# EAGLE design WSTL18P2 (EAGLE 7.7.0)
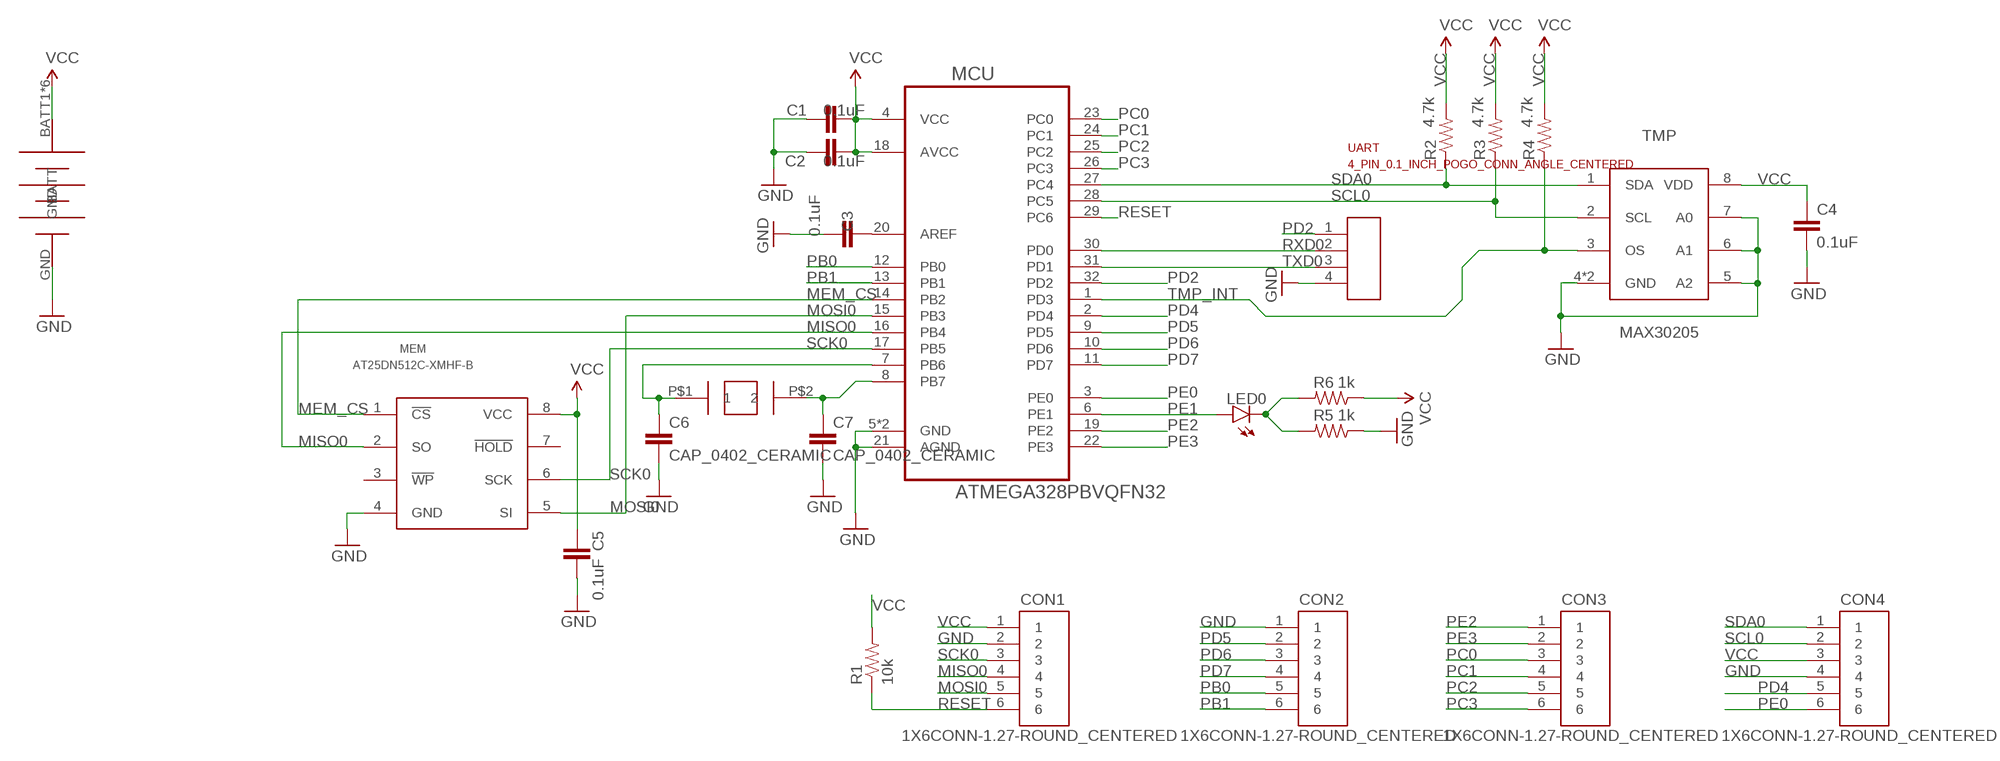
[diagram p0: schematic, sheet 1]

## Parts
C1  0.1uF  CAP_0402  [SMD_0402]
C2  0.1uF  CAP_0402  [SMD_0402]
C3  0.1uF  CAP_0402  [SMD_0402]
C4  0.1uF  CAP_0402_CERAMIC  [CAP_0402]
C5  0.1uF  CAP_0402_CERAMIC  [CAP_0402]
C6  CAP_0402_CERAMIC  [CAP_0402]
C7  CAP_0402_CERAMIC  [CAP_0402]
CON1  1X6CONN-1.27-ROUND_CENTERED  [1X6_1.27_ROUND_CENTERED]
CON2  1X6CONN-1.27-ROUND_CENTERED  [1X6_1.27_ROUND_CENTERED]
CON3  1X6CONN-1.27-ROUND_CENTERED  [1X6_1.27_ROUND_CENTERED]
CON4  1X6CONN-1.27-ROUND_CENTERED  [1X6_1.27_ROUND_CENTERED]
LED0  LED_0402  [LED_0402]
MCU  ATMEGA328PBVQFN32  [ATMEGA328PB_VFQFN32]
MEM  AT25DN512C-XMHF-B  [TSSSOP-8]
R1  10k  RES_0402_CERAMIC  [RES_0402]
R2  4.7k  RES_0402_CERAMIC  [RES_0402]
R3  4.7k  RES_0402_CERAMIC  [RES_0402]
R4  4.7k  RES_0402_CERAMIC  [RES_0402]
R5  1k  RES_0402_CERAMIC  [RES_0402]
R6  1k  RES_0402_CERAMIC  [RES_0402]
T1  ABS07AIG  [ABS07AIG]
TMP  MAX30205  [MAX30205_TDFN8]
U$1  LINX-CR2032-BAT-HLD-M-THM  [CR2032-LINX-M-THM]
UART  4_PIN_0.1_INCH_POGO_CONN_ANGLE_CENTERED  [4_PIN_0.1"_POGO_ANGLE_CENTERED]

## Nets
AREF: C3.1 MCU.20(AREF)
GND [GND]: C1.2 C2.2 C3.2 C4.2 C5.2 C6.2 C7.2 CON1.2 CON2.1 CON4.4 MCU.5(GND) MCU.21(AGND) MCU.PAD(GND) MEM.4(GND) R5.2 TMP.4(GND) TMP.5(A2) TMP.6(A1) TMP.7(A0) TMP.PAD(GND) U$1.GND UART.4
MEM_CS [Signal]: MCU.14(PB2) MEM.1(!CS!)
MISO0 [Signal]: CON1.4 MCU.16(PB4) MEM.2(SO)
MOSI0 [Signal]: CON1.5 MCU.15(PB3) MEM.5(SI)
N$1 [Signal]: C7.1 MCU.8(PB7) T1.P$2
N$2 [Signal]: C6.1 MCU.7(PB6) T1.P$1
N$4: LED0.CATHODE(C) R5.1 R6.1
PB0: CON2.5 MCU.12(PB0)
PB1: CON2.6 MCU.13(PB1)
PC0: CON3.3 MCU.23(PC0)
PC1: CON3.4 MCU.24(PC1)
PC2: CON3.5 MCU.25(PC2)
PC3: CON3.6 MCU.26(PC3)
PD2: MCU.32(PD2) UART.1
PD4: CON4.5 MCU.2(PD4)
PD5: CON2.2 MCU.9(PD5)
PD6: CON2.3 MCU.10(PD6)
PD7: CON2.4 MCU.11(PD7)
PE0: CON4.6 MCU.3(PE0)
PE1: LED0.ANODE(A) MCU.6(PE1)
PE2: CON3.1 MCU.19(PE2)
PE3: CON3.2 MCU.22(PE3)
RESET [Signal]: CON1.6 MCU.29(PC6) R1.2
RXD0 [Signal]: MCU.30(PD0) UART.2
SCK0 [Signal]: CON1.3 MCU.17(PB5) MEM.6(SCK)
SCL0 [Signal]: CON4.2 MCU.28(PC5) R3.2 TMP.2(SCL)
SDA0 [Signal]: CON4.1 MCU.27(PC4) R2.2 TMP.1(SDA)
TMP_INT: MCU.1(PD3) R4.2 TMP.3(OS)
TXD0 [Signal]: MCU.31(PD1) UART.3
VCC: C1.1 C2.1 C4.1 C5.1 CON1.1 CON4.3 MCU.4(VCC) MCU.18(AVCC) MEM.8(VCC) R1.1 R2.1 R3.1 R4.1 R6.2 TMP.8(VDD) U$1.BATT1(BATT) U$1.BATT2(BATT) U$1.BATT3(BATT) U$1.BATT4(BATT) U$1.BATT5(BATT) U$1.BATT6(BATT)
Unconnected: MEM.3(!WP!) MEM.7(!HOLD!)

## Library data of the parts
C1-C3 = Passives:CAP_0402: 0402 capacitor
C4-C7 = Passives:CAP_0402_CERAMIC
CON1-CON4 = AVR_ISP_127:1X6CONN-1.27-ROUND_CENTERED
LED0 = Passives:LED_0402
MCU = ATMEGA328PB:ATMEGA328PB: Atmel's new 8-bit Microcontroller with In-System Programmable Flash and other goodies to replace venerable 328P
MEM = Memory:AT25DN512C-XMHF-B
R1-R6 = Passives:RES_0402_CERAMIC
T1 = ABS07AIG:ABS07AIG: Abracon ABS07AIG crystal
TMP = MAX30205:MAX30205: MAX30205 Temperature sensor by Maxim
U$1 = Battery_holders:LINX-CR2032-BAT-HLD-M-THM
UART = Connectors:4_PIN_0.1_INCH_POGO_CONN_ANGLE_CENTERED

## Net classes
1 GND: width 0.254 mm, drill 0.305 mm, clearance 0.356 mm
2 Signal: width 0.203 mm, drill 0.305 mm, clearance 0.203 mm

## Board
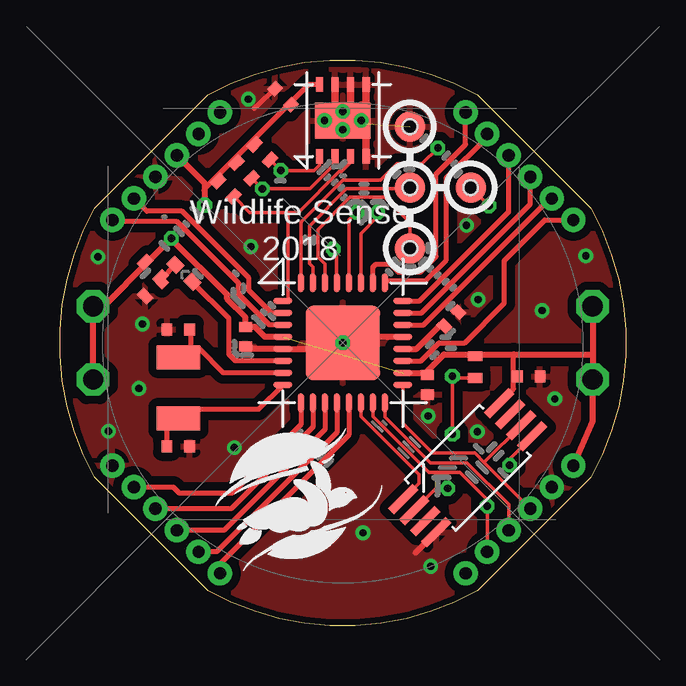
[diagram p1: board, top side]
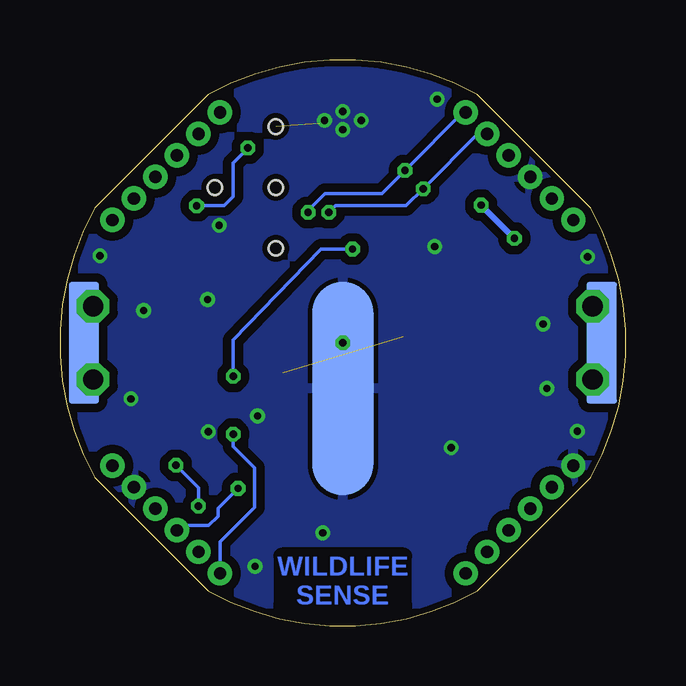
[diagram p2: board, bottom side, seen from below]

Size 23.59 x 23.59 mm. Coordinates in mm from the lower left corner, seen from the top.
Outline: 6.18,1.46 1.46,6.18 arc-59 1.46,17.41 6.18,22.13 arc-59 17.41,22.13 22.13,17.41 arc-59 22.13,6.18 17.41,1.46 arc-59 6.18,1.46
Copper layers (1*16): Top 0.035mm / dielectric 1.5mm / Bottom 0.035mm
Design rules "Nikos-SeeedStudio_2layer_DRU_no_angle_20140221": minimum track width 6mil, minimum drill 12mil, track to track 6mil, track to pad 10mil, pad to pad 10mil, via to via 10mil, smd to smd 6mil, copper to edge 10mil, drill to drill 10mil, minimum pad ring 10mil, minimum via ring 6mil, stop-mask expansion 0mil, vias tented up to drill 100mil, thermal gap 8mil
Holes 0.6 mm at 14.59,20.81 14.59,18.27 17.13,18.27 14.59,15.73

### Footprints (pad centres in the part's own frame; a part is rotated, then mirrored left to right if it is on the bottom)
SMD_0402 = smd 0.54 x 0.42: 1 0,0.41; 2 0,-0.41
CAP_0402 = smd 0.45 x 0.5: 1 -0.475,0; 2 0.475,0
1X6_1.27_ROUND_CENTERED = drill 0.508 pad 0.813: 1 -3.175,0; 2 -1.905,0; 3 -0.635,0; 4 0.635,0; 5 1.905,0; 6 3.175,0
LED_0402 = smd 0.6 x 0.5: ANODE -0.5,0; CATHODE 0.5,0
ATMEGA328PB_VFQFN32 = smd 0.8 x 0.25: 1 -2.5,1.75; 2 -2.5,1.25; 3 -2.5,0.75; 4 -2.5,0.25; 5 -2.5,-0.25; 6 -2.5,-0.75; 7 -2.5,-1.25; 8 -2.5,-1.75; 17 2.5,-1.75; 18 2.5,-1.25; 19 2.5,-0.75; 20 2.5,-0.25; 21 2.5,0.25; 22 2.5,0.75; 23 2.5,1.25; 24 2.5,1.75 | smd 0.25 x 0.8: 9 -1.75,-2.5; 10 -1.25,-2.5; 11 -0.75,-2.5; 12 -0.25,-2.5; 13 0.25,-2.5; 14 0.75,-2.5; 15 1.25,-2.5; 16 1.75,-2.5; 25 1.75,2.5; 26 1.25,2.5; 27 0.75,2.5; 28 0.25,2.5; 29 -0.25,2.5; 30 -0.75,2.5; 31 -1.25,2.5; 32 -1.75,2.5 | smd 3.1 x 3.1: PAD 0,0
TSSSOP-8 = smd 1.45 x 0.35: 1 -2.825,0.975; 2 -2.825,0.325; 3 -2.825,-0.325; 4 -2.825,-0.975; 5 2.825,-0.975; 6 2.825,-0.325; 7 2.825,0.325; 8 2.825,0.975
RES_0402 = smd 0.4 x 0.6: 1 -0.45,0; 2 0.45,0
ABS07AIG = smd 1.8 x 1: P$1 0,1.275; P$2 0,-1.275
MAX30205_TDFN8 = smd 0.6 x 0.3: 1 -1.5,0.975; 2 -1.5,0.325; 3 -1.5,-0.325; 4 -1.5,-0.975; 5 1.5,-0.975; 6 1.5,-0.325; 7 1.5,0.325; 8 1.5,0.975 | smd 1.5 x 2.3: PAD 0,0
CR2032-LINX-M-THM = drill 0.838 octagon: BATT1 -10.414,1.524; BATT2 -10.414,-1.524; BATT3 10.414,-1.524; BATT4 10.414,1.524 | smd 1.27 x 5.08: BATT5 -10.795,0; BATT6 10.795,0 | smd 2.54 x 8.89: GND 0,-1.905
4_PIN_0.1"_POGO_ANGLE_CENTERED = smd 1.27 x 1.27: 1 0,2.54; 2 2.54,0; 3 0,0; 4 -2.54,0

### Placement (x,y rotation side)
C1  7.73,12.05 0 top
C2  15.33,10.04 0 top
C3  16.32,12.79 135 top
C4  9.31,22.06 135 top
C5  19.54,10.4 0 top
C6  4.94,12.35 180 top
C7  4.94,7.48 0 top
CON1  19.16,4.43 225 top
CON2  4.43,4.43 315 top
CON3  19.16,19.16 135 top
CON4  4.43,19.16 225 top
LED0  5.17,14.69 135 top
MCU  11.8,11.8 0 top
MEM  17,6.59 45 top
R1  17.31,10.78 270 top
R2  8.44,19.75 315 top
R3  7.68,18.98 315 top
R4  6.92,18.22 315 top
R5  3.87,14.06 225 top
R6  3.87,14.84 135 top
T1  4.94,9.92 0 top
TMP  11.8,21.07 90 top
U$1  11.8,11.8 0 bottom
UART  14.59,18.27 270 top

### Tracks (layer width: path | path; a pad name or v marks a point on that pad's centre or on a via)
AREF
  Top 0.249: MCU.20 14.87,11.55 15.82,12.5 C3.1
GND  (via drill 0.3)  (1 unrouted)
  Top 0.203: C4.2 8.24,21.68 8.11,21.57
  Top 0.249: 11.03,11.55 MCU.5 8.05,11.55
  Top 0.254: 11.03,11.55 11.28,11.8 MCU.PAD 12.05,12.05 MCU.21 | 14.84,3.06 15.61,3.82 | 8.05,11.55 C1.2
  Top 0.305: TMP.4 12.77,20.94 v12.56,21.07 | TMP.5 12.77,21.7 12.56,21.7 | TMP.6 12.12,21.45 v11.8,21.45 | TMP.7 11.47,21.7 v11.03,21.07
  other vias: 2.02,8.11 11.8,20.69 3.29,9.89 15.35,8.75 21.93,15.43 1.58,15.38 7.27,7.43 7.96,15.81 20.63,9.46 20.1,13.14 16.95,16.7 15.45,2.47 12.63,3.87 3.44,12.58 7.86,21.96 11.8,11.8 17.43,13.6 17.41,8.09
  pour Bottom: -1.41,-1.41 25.77,-1.41 25.77,26.4 -1.41,26.4
  pour Top: -1.41,-1.41 25.13,-1.41 25.13,26.02 -1.41,26.02
MEM_CS
  Top 0.152: MCU.14 12.55,8.73 14.97,6.31 14.97,5.94 MEM.1
MISO0  (via drill 0.3)
  Top 0.152: MCU.16 13.55,8.7 15.45,6.79 16.98,6.79 18.71,5.06 CON1.4 | MEM.2 15.68,5.72 v16.16,5.72
  Bottom 0.152: v16.16,5.72 17,4.89 17,4.56 17.38,4.18 18.52,4.18 CON1.4
MOSI0  (via drill 0.3)
  Top 0.152: MCU.15 13.05,8.72 15.38,6.39 16.67,6.39 17.81,5.24 v17.81,4.99 CON1.5 | MEM.5 18.76,6.96 v18.76,6.69
  Bottom 0.152: v18.76,6.69 17.81,5.75 v17.81,4.99
N$1
  Top 0.203: MCU.8 8.27,9.02 4.94,9.02 T1.P$2 4.46,8.64 C7.1
N$2
  Top 0.203: MCU.7 6.82,10.55 5.8,11.57 5.45,11.57 | 4.91,11.16 T1.P$1 4.94,11.57 5.45,11.57 | C6.1 5.45,12.35 5.45,11.57
N$4
  Top 0.203: R5.1 R6.1 4.29,14.53 LED0.CATHODE
PB0
  Top 0.203: MCU.12 11.55,8.07 6.63,3.17 6.54,3.08 CON2.5
PB1
  Top 0.203: MCU.13 12.05,7.96 6.67,2.59 CON2.6
PC0
  Top 0.203: MCU.23 15.08,13.05 19.61,17.58 CON3.3
PC1
  Top 0.203: MCU.24 14.99,13.55 18.71,17.26 CON3.4
PC2
  Top 0.203: MCU.25 13.64,14.39 15.25,14.39 16.11,15.25 16.11,18.68 17.81,20.38 CON3.5
PC3
  Top 0.203: MCU.26 13.05,14.95 13.17,15.07 13.78,15.07 14.11,14.74 15.02,14.74 15.68,15.4 15.68,18.83 16.92,20.07 CON3.6
PD2  (via drill 0.3)
  Top 0.152: MCU.32 10.05,16.83 11.8,18.58 13.37,18.58 14.06,19.26 15.1,19.26 v15.76,19.92 | v17.89,17.51 UART.1
  Bottom 0.152: v15.76,19.92 15.76,19.9 16.37,19.29 16.37,17.89 16.75,17.51 v17.89,17.51
PD4
  Top 0.203: MCU.2 8.82,13.05 7.88,13.98 7.88,14.49 5.09,17.28 3.62,17.28 CON4.5
PD5
  Top 0.203: MCU.9 10.05,8.39 7.17,5.52 4.99,5.52 4.73,5.78 CON2.2
PD6
  Top 0.203: MCU.10 10.55,8.28 7.14,4.88 CON2.3
PD7
  Top 0.203: MCU.11 11.05,8.18 6.85,3.98 CON2.4
PE0
  Top 0.203: MCU.3 8.73,12.55 7.45,13.83 7.45,14.28 4.89,16.85 2.26,16.85 CON4.6
PE1
  Top 0.203: MCU.6 7.31,11.05 7.05,11.31 7.05,12.81 LED0.ANODE
PE2
  Top 0.203: MCU.19 15.06,11.05 15.81,11.8 16.88,11.8 18.53,13.45 18.53,15.22 20.22,16.92 CON3.1
PE3
  Top 0.203: MCU.22 15.16,12.55 20.43,17.81 CON3.2
RESET  (via drill 0.3)
  Top 0.152: MCU.29 11.54,15.55 v11.39,15.71 | R1.2 16.44,10.33 v16.37,10.4 v16.37,7.99
  Top 0.254: MCU.29
  Bottom 0.152: v11.39,15.71 12.71,15.71 16.37,11.92 v16.37,10.4 | v16.37,7.99 16.37,7.48 15.48,6.59 15.48,4.94 16.92,3.5 CON1.6
RXD0
  Top 0.152: MCU.30 11.05,15.09 10.75,15.38 10.75,16.52 12.1,17.87 13.52,17.87 14.59,16.8 UART.2
SCK0
  Top 0.152: MCU.17 14.3,8.43 15.53,7.2 17.3,7.2 17.71,6.79 | CON1.3 17.71,6.79 | MEM.6 17.71,6.83 17.71,6.79
SCL0  (via drill 0.3)
  Top 0.152: MCU.28 12.05,16.93 v12.38,17.23 | R3.2 v8.44,18.22 | v8.44,18.22 | v8.44,18.22 10.42,18.22 11.47,19.27 TMP.2
  Bottom 0.152: v12.38,17.23 12.1,17.51 9.15,17.51 v8.44,18.22 6.16,20.51 CON4.2
SDA0  (via drill 0.3)
  Top 0.152: R2.2 v9.2,18.98 | v9.2,18.98 | MCU.27 12.55,16.36 13.24,17.05 v13.24,17.23 | v9.2,18.98 10.6,18.98 10.82,19.2 TMP.1
  Bottom 0.152: v13.24,17.23 13.24,17.31 12.53,18.02 10.17,18.02 v9.2,18.98 6.78,21.41 CON4.1
TMP_INT
  Top 0.152: TMP.3 12.12,19.3 11.75,18.93 11.64,18.93 9.94,17.23 9.51,17.23 | MCU.1 9.51,13.55 9.51,17.23 | 9.51,17.23 7.91,17.23 R4.2
TXD0
  Top 0.152: MCU.31 10.55,14.95 10.4,15.1 10.4,16.67 11.95,18.22 14.54,18.22 UART.3
VCC  (via drill 0.3)  (1 unrouted)
  Top 0.203: C2.1 15.48,10.55 | 6.06,17.54 v6.03,17.54 | MEM.8 18.91,9.87 18.91,10.4 | 18.91,10.4 18.91,11.31 | TMP.8 10.37,22.57 9.57,21.76 | C4.1 9.6,21.76 9.57,21.76 | 9.57,21.76 7.86,20.05 | 7.86,20.05 7.1,19.29 | 7.1,19.29 6.46,18.65 | R4.1 6.49,18.65 6.46,18.65 | R3.1 7.35,19.29 7.1,19.29 | R2.1 8.11,20.05 7.86,20.05 | R6.2 3.66,15.16 3.69,15.2 | 6.46,18.65 6.03,18.22 6.03,18.15 | C5.1 18.91,10.4
  Top 0.249: MCU.4 8.55,12.05 8.13,12.46 C1.1 7.73,12.86 6.97,13.62 6.97,13.8 4.65,16.13 v4.65,16.15
  Top 0.254: MCU.18 15.24,10.55 | 15.48,10.55 15.24,10.55 | CON1.1 22.21,8.54 U$1.BATT2 22.21,11.31 | U$1.BATT1 22.21,11.31 | U$1.BATT3 U$1.BATT4 1.81,13.32 3.69,15.2 v4.65,16.15 4.65,16.13 | 15.24,10.55 16.01,11.31 17.26,11.31 | 17.26,11.31 18.91,11.31 22.21,11.31 | R1.1 17.31,11.26 17.26,11.31 | CON4.3 6.03,18.46 6.03,18.15 v6.03,17.54
  Bottom 0.203: U$1.BATT6 1.38,11.8 U$1.BATT4 | U$1.BATT5 22.21,11.8 U$1.BATT2
  Bottom 0.254: v4.65,16.15 v6.03,17.54

### Text on the board
Bottom: WILDLIFE / SENSE
tPlace: Wildlife Sense / 2018
tStop: WSTL18P2